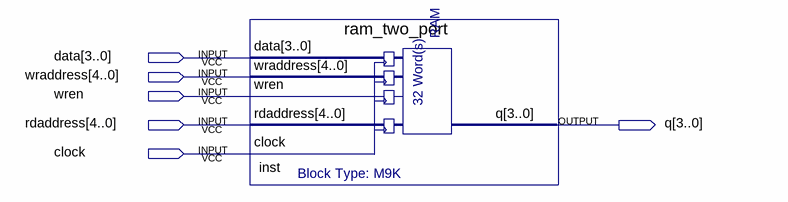
[diagram p0: schematic sheet]
// Quartus schematic two_port_ram_test.bdf as structural Verilog: 1 symbols, 6 pins
module two_port_ram_test (
  input  [3:0] data,
  input  [4:0] wraddress,
  input  wren,
  input  [4:0] rdaddress,
  input  clock,
  output [3:0] q
);

  ram_two_port inst (.data(data), .wraddress(wraddress), .wren(wren), .rdaddress(rdaddress), .clock(clock), .q(q));
endmodule
